# EAGLE design Mega Relay Interface (EAGLE 7.1.0)
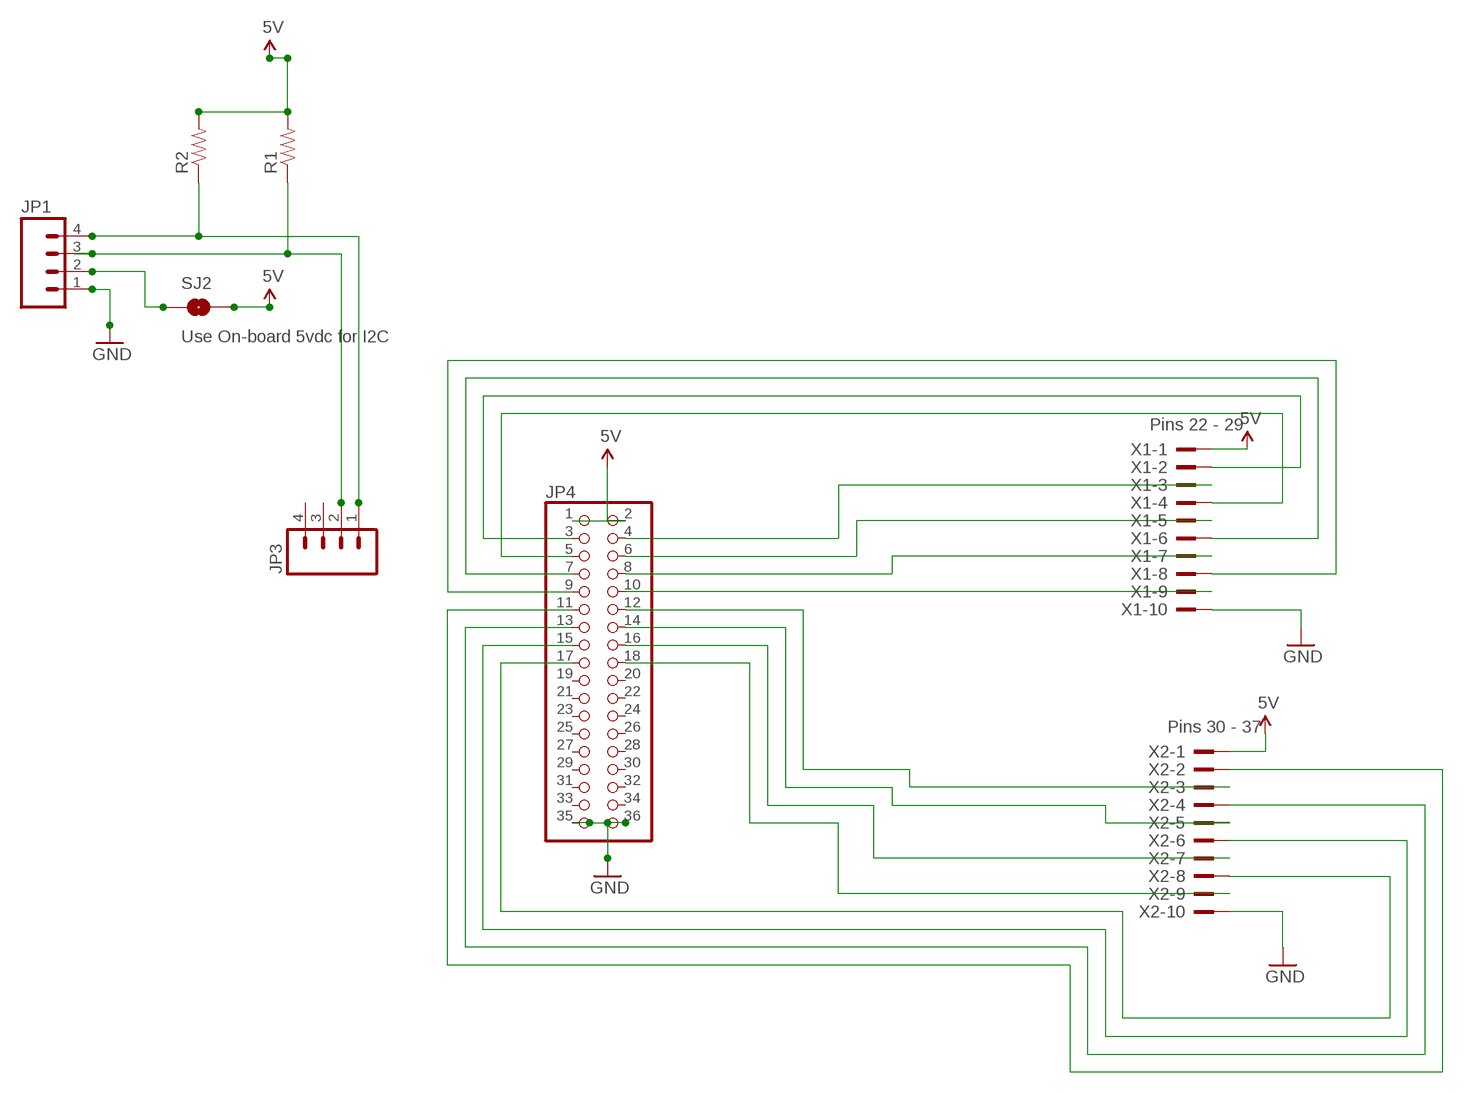
[diagram p0: schematic, sheet 1]

## Parts
JP1  M04PTH  [1X04]
JP3  M04PTH  [1X04]
JP4  PINHD-2X18  [2X18]
R1  RESISTORAXIAL-0.3  [AXIAL-0.3]
R2  RESISTORAXIAL-0.3  [AXIAL-0.3]
SJ2  Use On-board 5vdc for I2C  SOLDERJUMPERNC  [SJ_2S]
X1  Pins 22 - 29  2510-  [PAK100/2500-10]
X2  Pins 30 - 37  2510-  [PAK100/2500-10]

## Nets
5V: JP4.1 JP4.2 R1.P$2 R2.P$2 SJ2.2 X1.1 X2.1
GND: JP1.1 JP4.35 JP4.36 X1.10 X2.10
N$1: JP4.3 X1.2
N$2: JP4.4 X1.3
N$3: JP4.5 X1.4
N$4: JP4.7 X1.6
N$5: JP4.6 X1.5
N$6: JP4.9 X1.8
N$7: JP4.8 X1.7
N$8: JP4.11 X2.2
N$9: JP4.10 X1.9
N$10: JP4.12 X2.3
N$11: JP4.14 X2.5
N$12: JP4.16 X2.7
N$13: JP4.18 X2.9
N$14: JP1.2 SJ2.1
N$16: JP4.13 X2.4
N$17: JP4.15 X2.6
N$18: JP4.17 X2.8
N$19: JP1.3 JP3.2 R1.P$1
N$20: JP1.4 JP3.1 R2.P$1
Unconnected: JP3.3 JP3.4 JP4.19 JP4.20 JP4.21 JP4.22 JP4.23 JP4.24 JP4.25 JP4.26 JP4.27 JP4.28 JP4.29 JP4.30 JP4.31 JP4.32 JP4.33 JP4.34

## Library data of the parts
JP1 JP3 = SparkFun-Connectors:M04: Header 4 Standard 4-pin 0.1" header. Use with straight break away headers (SKU : PRT-00116), right angle break away headers (PRT-00553), swiss pins (PRT-00743), machine pins (PRT-00117), and female headers (PRT-00115). Molex polarized connector foot print use with SKU : PRT-08231 with associated crimp pins and housings. 1MM SMD Version SKU: PRT-10208
JP4 = pinhead:PINHD-2X18: PIN HEADER
R1 R2 = SparkFun-Passives:RESISTOR: Resistor Basic schematic elements and footprints for 0603, 1206, and PTH resistors.
SJ2 = SparkFun-Retired:SOLDERJUMPER: Solder Jumper Standard SMD solder jumper. Used to automate production. Two varients : Normally Open and Normally Closed are the same, but have different paste layers. NC will have a large amount of paste and should jumper during reflow.
X1 X2 = con-3m:2510-: 3M (TM) Pak 100 4-Wall Header Source: 3M; MF: 3M; MPN: 2510-6002UB; OC_FARNELL: 9838244; OC_NEWARK: 46F4725

## Board
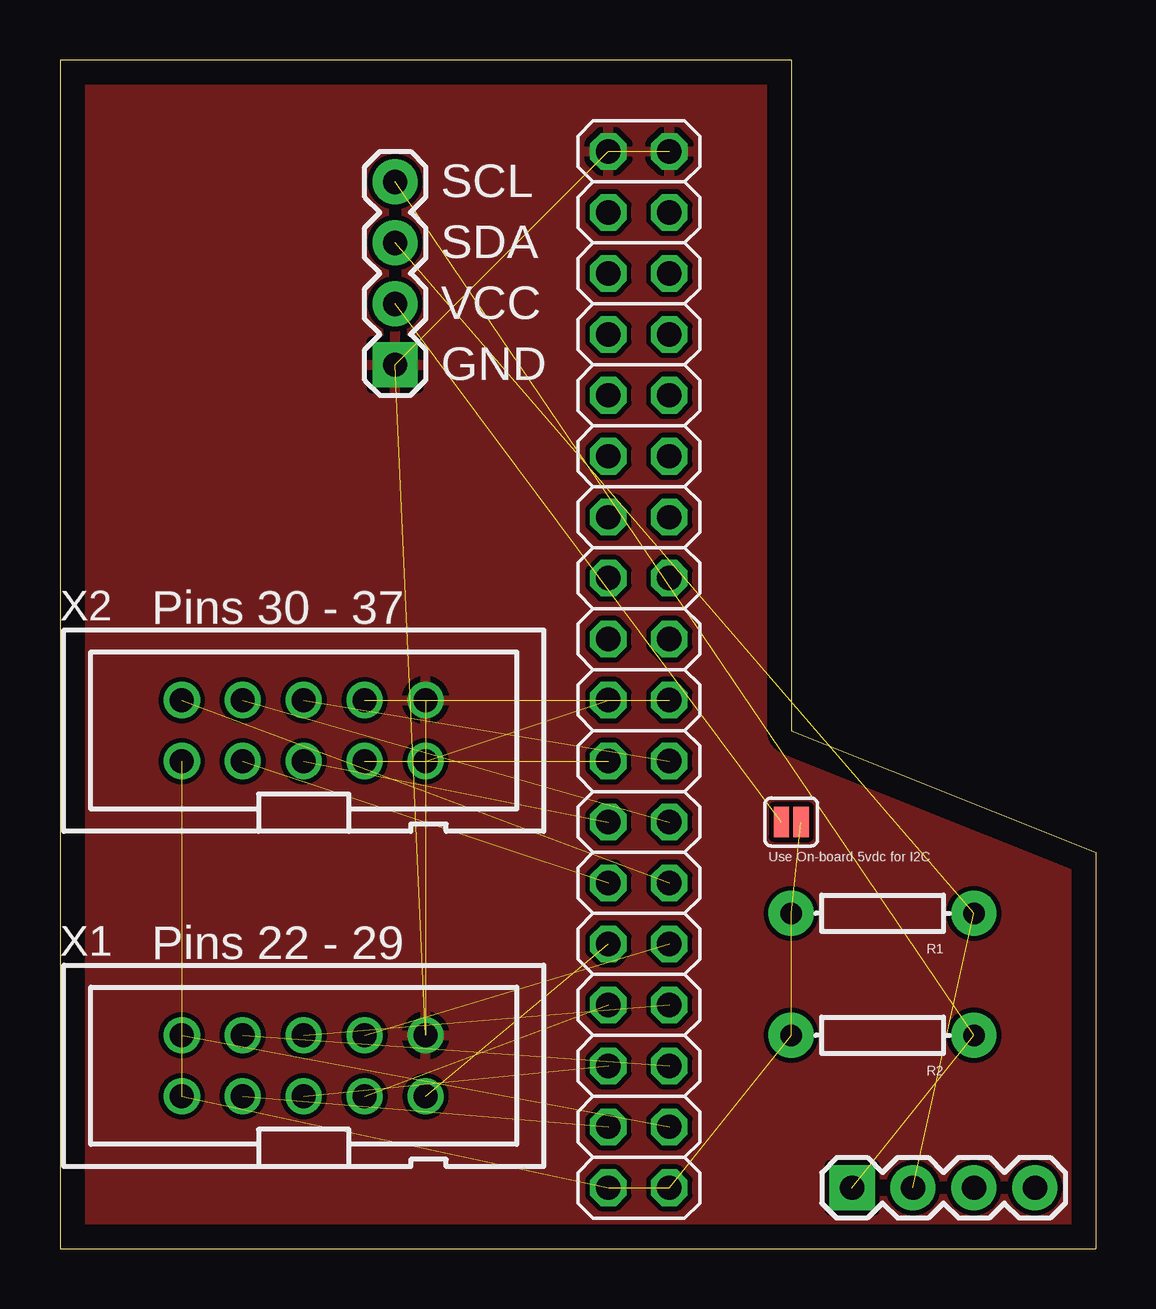
[diagram p1: board, top side]
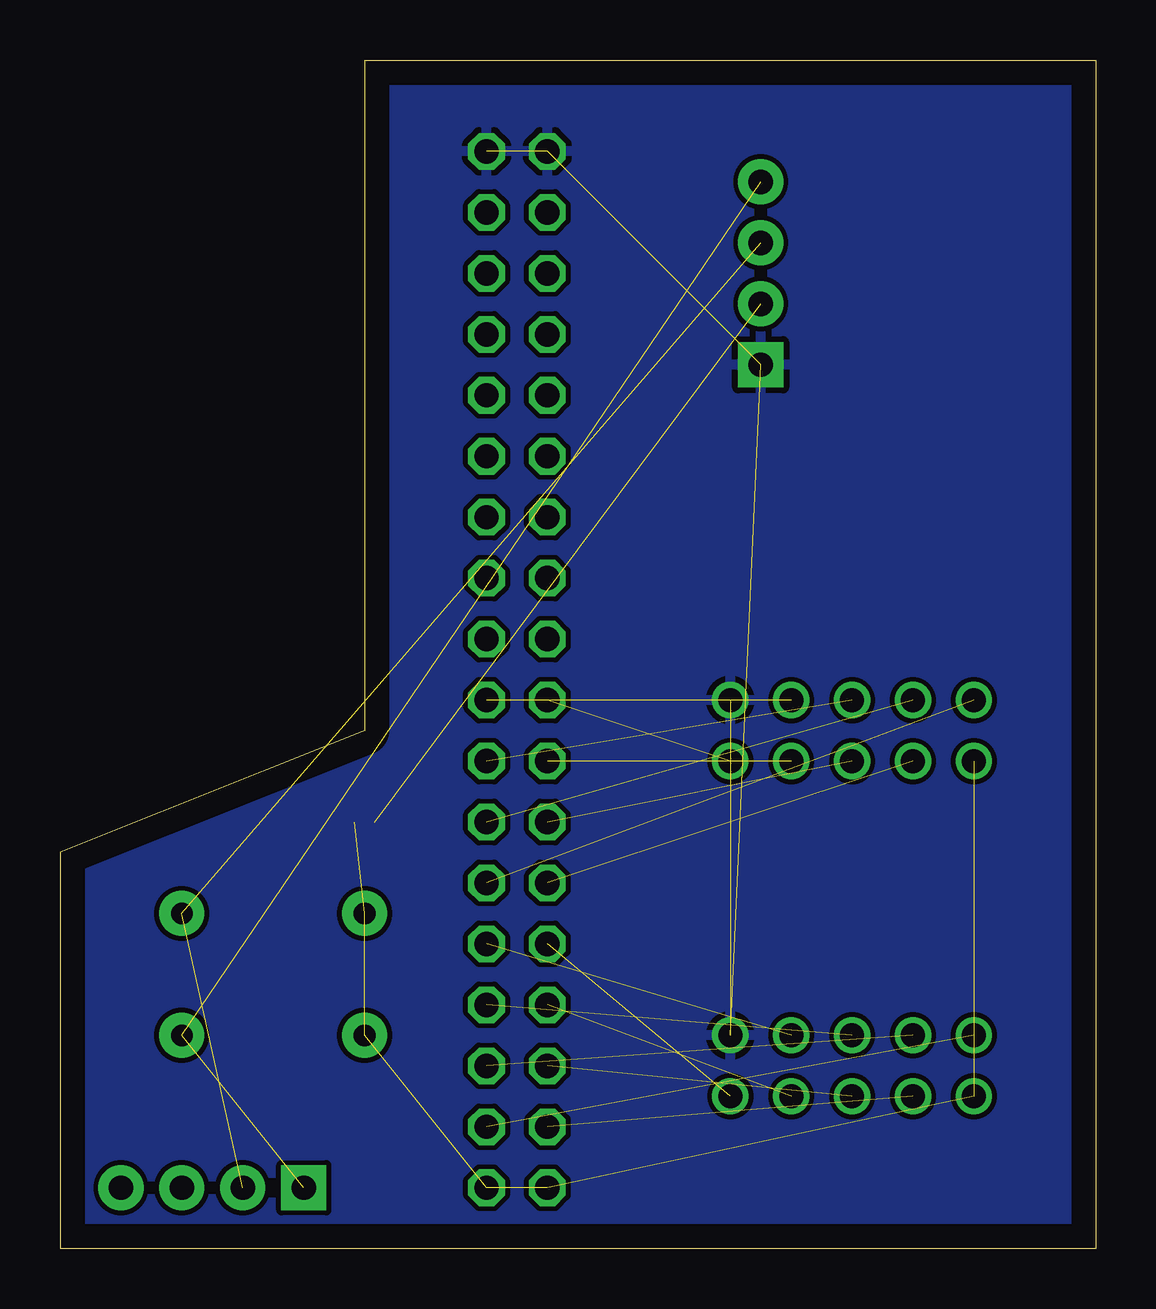
[diagram p2: board, bottom side, seen from below]

Size 43.18 x 49.53 mm. Coordinates in mm from the lower left corner, seen from the top.
Outline: 0,0 43.18,0 43.18,16.51 30.48,21.59 30.48,49.53 0,49.52 0,0
Copper layers (1*16): Top 0.035mm / dielectric 1.5mm / Bottom 0.035mm
Design rules "default": minimum track width 10mil, minimum drill 24mil, track to track 8mil, track to pad 8mil, pad to pad 8mil, via to via 8mil, smd to smd 8mil, copper to edge 40mil, drill to drill 8mil, minimum pad ring 10mil, minimum via ring 8mil, stop-mask expansion 4mil, vias tented up to drill 0mil, thermal gap 10mil

### Footprints (pad centres in the part's own frame; a part is rotated, then mirrored left to right if it is on the bottom)
1X04 = drill 1.016 pad 1.88 square: 1 0,0 | drill 1.016 pad 1.88: 2 2.54,0; 3 5.08,0; 4 7.62,0
2X18 = drill 1.016 octagon: 1 -21.59,-1.27; 2 -21.59,1.27; 3 -19.05,-1.27; 4 -19.05,1.27; 5 -16.51,-1.27; 6 -16.51,1.27; 7 -13.97,-1.27; 8 -13.97,1.27; 9 -11.43,-1.27; 10 -11.43,1.27; 11 -8.89,-1.27; 12 -8.89,1.27; 13 -6.35,-1.27; 14 -6.35,1.27; 15 -3.81,-1.27; 16 -3.81,1.27; 17 -1.27,-1.27; 18 -1.27,1.27; 19 1.27,-1.27; 20 1.27,1.27; 21 3.81,-1.27; 22 3.81,1.27; 23 6.35,-1.27; 24 6.35,1.27; 25 8.89,-1.27; 26 8.89,1.27; 27 11.43,-1.27; 28 11.43,1.27; 29 13.97,-1.27; 30 13.97,1.27; 31 16.51,-1.27; 32 16.51,1.27; 33 19.05,-1.27; 34 19.05,1.27; 35 21.59,-1.27; 36 21.59,1.27
AXIAL-0.3 = drill 0.9 pad 1.88: P$1 -3.81,0; P$2 3.81,0
SJ_2S = smd 0.635 x 1.27: 1 -0.412,0; 2 0.412,0
PAK100/2500-10 = drill 1 pad 1.422: 1 -5.08,-1.27; 2 -5.08,1.27; 3 -2.54,-1.27; 4 -2.54,1.27; 5 0,-1.27; 6 0,1.27; 7 2.54,-1.27; 8 2.54,1.27; 9 5.08,-1.27; 10 5.08,1.27

### Placement (x,y rotation side)
JP1  13.97,36.83 90 top
JP3  33.02,2.54 0 top
JP4  24.13,24.13 90 top
R1  34.29,13.97 180 top
R2  34.29,8.89 180 top
SJ2  30.48,17.78 0 top
X1  10.16,7.62 0 top
X2  10.16,21.59 0 top

### Tracks (layer width: path | path; a pad name or v marks a point on that pad's centre or on a via)
5V  (6 unrouted)
GND  (4 unrouted)
  pour Bottom: -6.35,53.09 45.72,53.34 46.48,-6.1 -6.86,-6.35
  pour Top: -3.81,51.82 43.18,52.07 45.21,-3.56 -4.32,-3.81
N$1  (1 unrouted)
N$2  (1 unrouted)
N$3  (1 unrouted)
N$4  (1 unrouted)
N$5  (1 unrouted)
N$6  (1 unrouted)
N$7  (1 unrouted)
N$8  (1 unrouted)
N$9  (1 unrouted)
N$10  (1 unrouted)
N$11  (1 unrouted)
N$12  (1 unrouted)
N$13  (1 unrouted)
N$14  (1 unrouted)
N$16  (1 unrouted)
N$17  (1 unrouted)
N$18  (1 unrouted)
N$19  (2 unrouted)
N$20  (2 unrouted)

### Text on the board
tNames: SCL | SDA | VCC | GND | Pins 30 - 37 | Pins 22 - 29